# Altium schematic sheet cuatudong.SchDoc
size A3; SheetNumber: 1; SheetTotal: 1
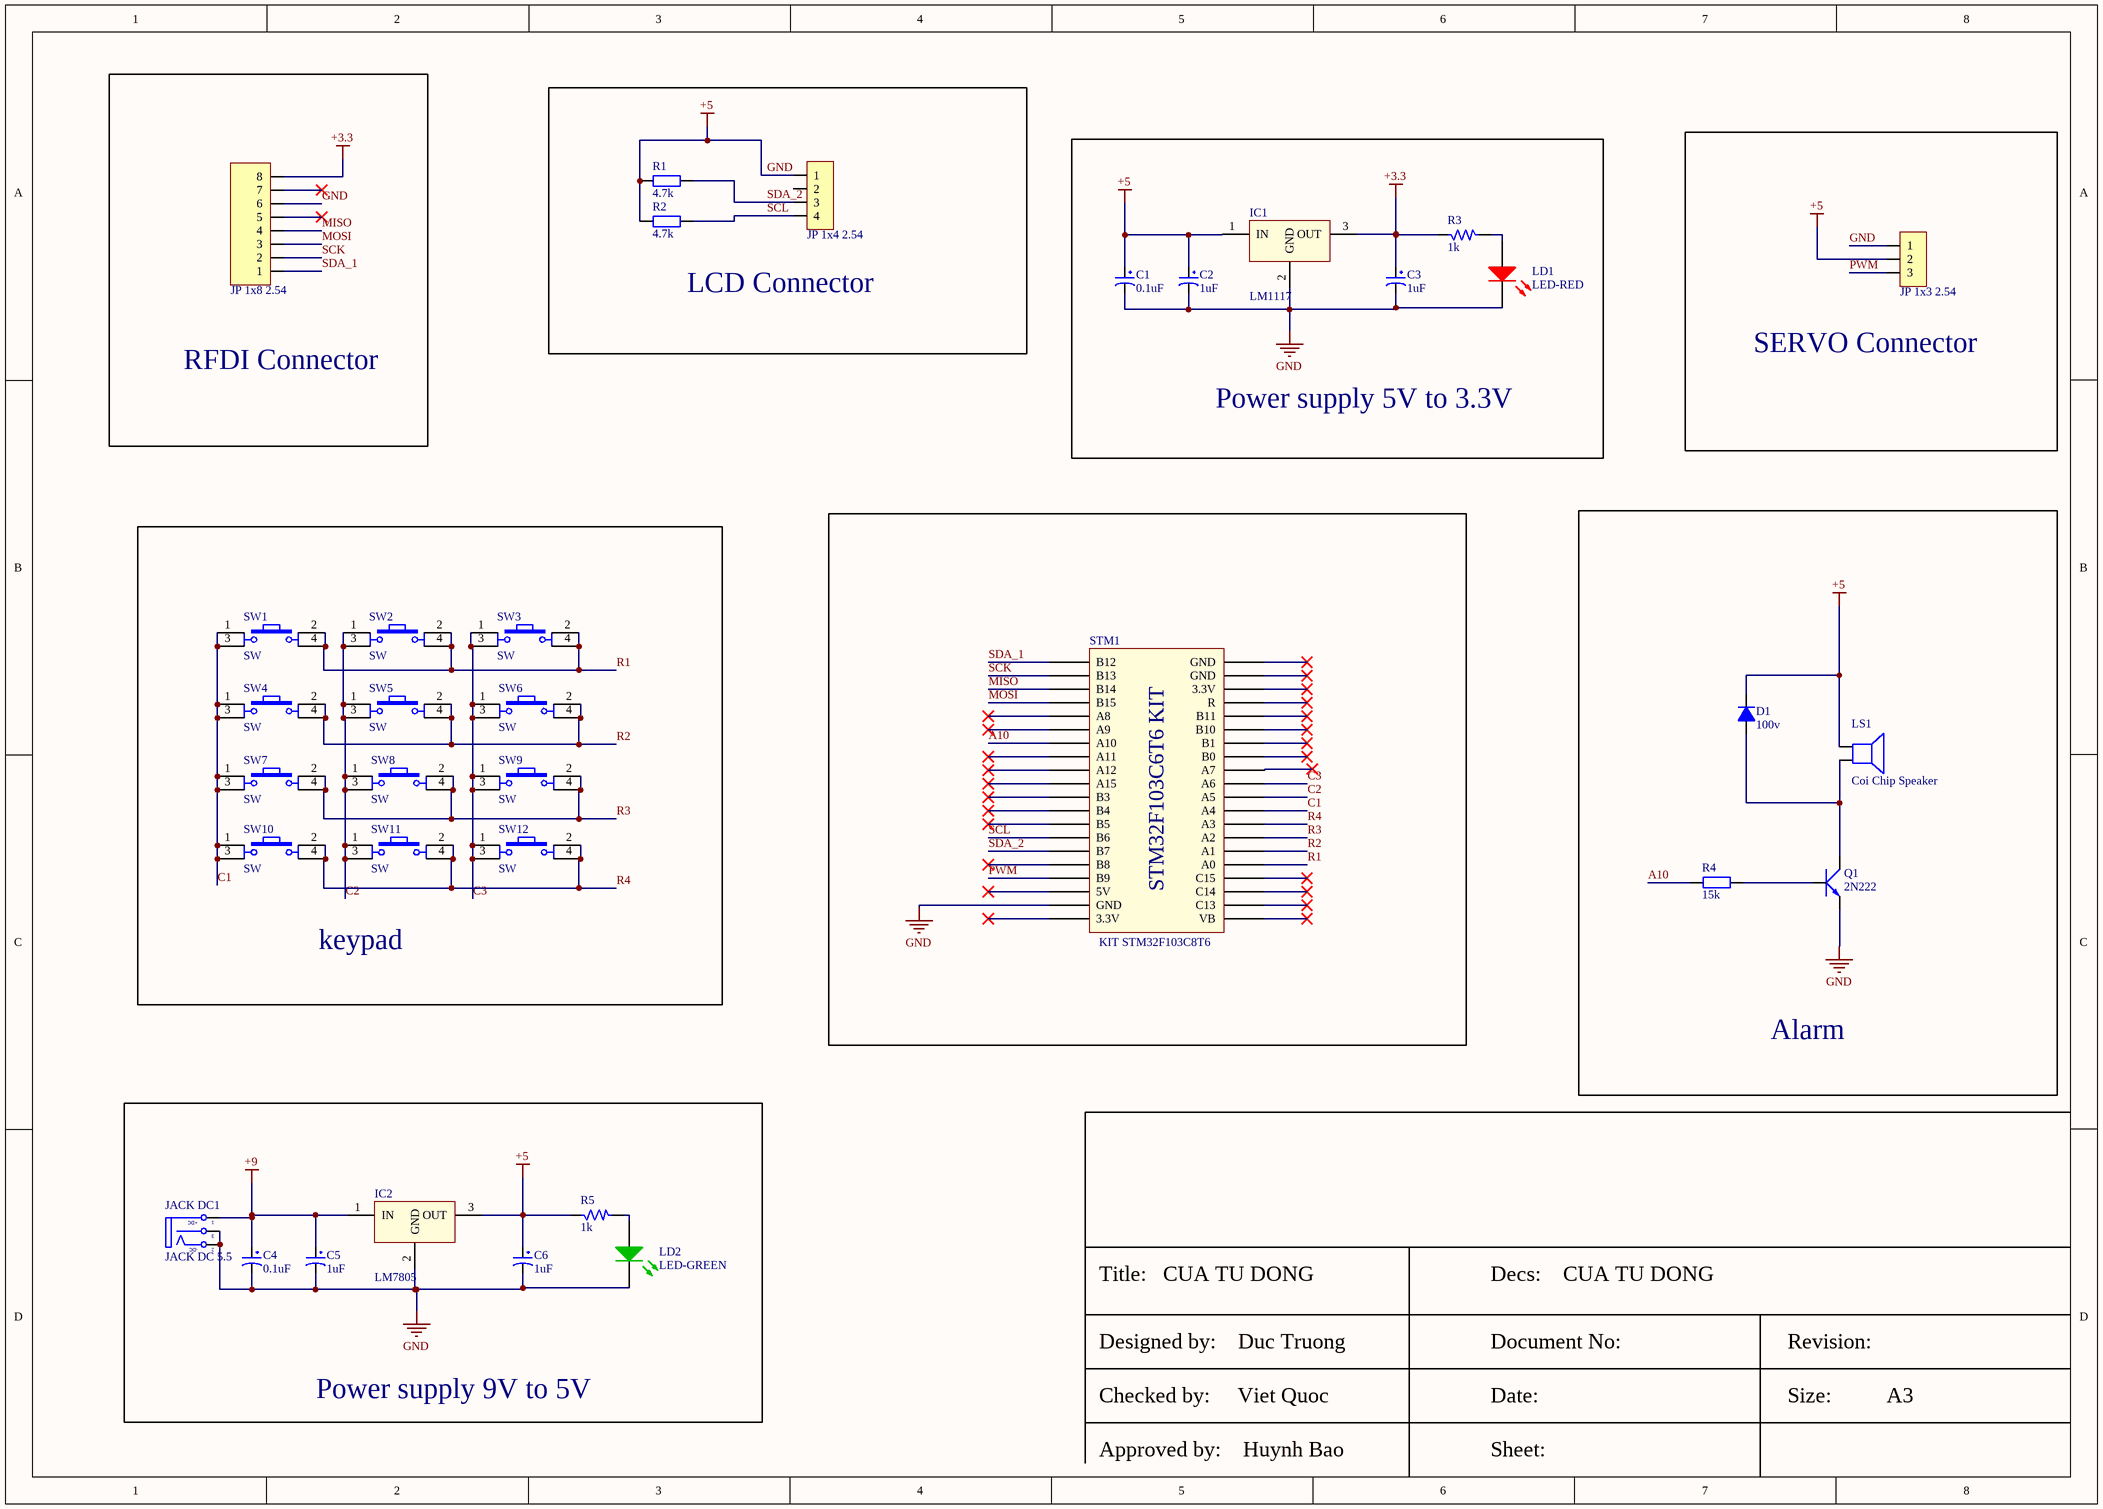
[diagram p0: cuatudong.SchDoc]

## Parts
C1  0.1uF  [tu hoa 5mm]
C2  1uF  [tu hoa 5mm]
C3  1uF  [tu hoa 5mm]
C4  0.1uF  [tu hoa 5mm]
C5  1uF  [tu hoa 5mm]
C6  1uF  [tu hoa 5mm]
D1  100v  [DIODE 0.5A]
IC1  LM1117  [QTO-220]
IC2  LM7805  [QTO-220]
JACK_DC1  JACK DC 5.5  [JACK DC 5.5]
JP1  JP 1x8 2.54  [JP 1x8 CT]
JP2  JP 1x4 2.54  [JP 1x4 CT]
JP3  JP 1x3 2.54  [JP 1x3 DT]
LD1  LED-RED  [LED_SMD0603_RED]
LD2  LED-GREEN  [LED_SMD0805_GREEN]
LS1  Coi Chip Speaker  [Coi Chip Speacker]
Q1  2N222  [TO92]
R1  4.7k  [tro cong suat 5w]
R2  4.7k  [tro cong suat 5w]
R3  1k  [R1/8W]
R4  15k  [tro vach 1/4w]
R5  1k  [R1/8W]
STM1  KIT STM32F103C8T6  [STM32F103 KIT]
SW1  SW  [SW4]
SW2  SW  [SW4]
SW3  SW  [SW4]
SW4  SW  [SW4]
SW5  SW  [SW4]
SW6  SW  [SW4]
SW7  SW  [SW4]
SW8  SW  [SW4]
SW9  SW  [SW4]
SW10  SW  [SW4]
SW11  SW  [SW4]
SW12  SW  [SW4]

## Blocks framed on the sheet
RFDI Connector: JP1
LCD Connector: JP2 R1 R2
Power supply 5V to 3.3V: C1-C3 IC1 LD1 R3
SERVO Connector: JP3
keypad: SW1-SW12
Alarm: D1 LS1 Q1 R4
Power supply 9V to 5V: C4-C6 IC2 JACK_DC1 LD2 R5

## Nets
+3.3: C3.1 IC1.3(OUT) JP1.8 R3.1
+9: C4.1 C5.1 IC2.1(IN) JACK_DC1.1(T)
GND: C1.1 C1.2 C2.1 C2.2 C3.2 C4.2 C5.2 C6.1 C6.2 D1.2(K) IC1.1(IN) IC1.2(GND) IC2.2(GND) IC2.3(OUT) JACK_DC1.2(TN) JACK_DC1.3(S) JP1.6 JP2.1 JP3.1 JP3.2 LD1.2(K) LD2.2(K) LS1.1 Q1.1(E) R1.1 R2.1 R5.1 STM1.19(GND)  [also labelled +5]
A10: R4.1 STM1.7(A10)
C1: STM1.29(A4) SW1.1 SW1.3 SW4.1 SW4.3 SW7.1 SW7.3 SW10.1 SW10.3
C2: STM1.30(A5) SW2.1 SW2.3 SW5.1 SW5.3 SW8.1 SW8.3 SW11.1 SW11.3
C3: STM1.31(A6) SW3.1 SW3.3 SW6.1 SW6.3 SW9.1 SW9.3 SW12.1 SW12.3
MISO: JP1.4 STM1.3(B14)
MOSI: JP1.3 STM1.4(B15)
PWM: JP3.3 STM1.17(B9)
R1: STM1.25(A0) SW1.2 SW1.4 SW2.2 SW2.4 SW3.2 SW3.4
R2: STM1.26(A1) SW4.2 SW4.4 SW5.2 SW5.4 SW6.2 SW6.4
R3: STM1.27(A2) SW7.2 SW7.4 SW8.2 SW8.4 SW9.2 SW9.4
R4: STM1.28(A3) SW10.2 SW10.4 SW11.2 SW11.4 SW12.2 SW12.4
SCK: JP1.2 STM1.2(B13)
SCL: JP2.4 R2.2 STM1.14(B6)
SDA_1: JP1.1 STM1.1(B12)
SDA_2: JP2.3 R1.2 STM1.15(B7)
NetD1_1: D1.1(A) LS1.2 Q1.3(C)
NetLD1_1: LD1.1(A) R3.2
NetLD2_1: LD2.1(A) R5.2
NetQ1_2: Q1.2(B) R4.2

Not connected (* = marked no-connect by the designer): JP1 5* 7*; JP2 2; STM1 5(A8)* 6(A9)* 8(A11)* 9(A12)* 10(A15)* 11(B3)* 12(B4)* 13(B5)* 16(B8)* 18(5V)* 20(3.3V)* 21(VB)* 22(C13)* 23(C14)* 24(C15)* 32(A7)* 33(B0)* 34(B1)* 35(B10)* 36(B11)* 37(R)* 38(3.3V)* 39(GND)* 40(GND)*

## Notes on the sheet
- Title:   CUA TU DONG
- Decs:    CUA TU DONG
- Designed by:    Duc Truong
- Document No:
- Revision:
- Checked by:     Viet Quoc
- Approved by:    Huynh Bao
- Date:
- Sheet:
- Size:          A3
- (in symbol JACK DC 5.5) +DC; -DC
- (in symbol STM32f103 Bluepill) STM32F103C6T6 KIT

## Library data of the parts
C1 C4 = Tu Hoa 0.1uF 50V 5x11: Cắm; Don_Vi: Con; So_Chan: 2; Ten_Linh_Kien: Tụ Hóa 0.1uF 50V; Ma_Hang: MH006853; Chung_Loai: Cắm; Kieu_Chan: *
C2 C3 C5 C6 = Tu Hoa 1uF 400V 6x10: Cắm; Don_Vi: Con; So_Chan: 2; Ten_Linh_Kien: Tụ Hóa 1uF 400V 6x10MM; Ma_Hang: MH003742; Chung_Loai: Cắm; Kieu_Chan: *
D1 = Diode 1N4148: Cắm; Ten_Linh_Kien: Diode 1N4148 DO35 450mA 100V ( 1N4148 DIP); Don_Vi: Con; Ma_Hang: MH001065; Ghi Chu: *; Kieu_Chan: *; Chung_Loai: Cắm
IC1 = LM78xx: On ap +, from + 5 to + 24VDC; Value: LM7805
IC2 = LM78xx: On ap +, from + 5 to + 24VDC; Value: LM7805
JACK_DC1 = JACK DC 5.5: Value: Jac DC
JP1 = JP 1x8 2.54 Cai Thang: Cắm; Ten_Linh_Kien: Jump Đơn Cái 2.54MM 1x20P Thẳng; Don_Vi: Con; Ma_Hang: MH004006; Ghi_Chu: *; Kieu_Chan: *; Chung_Loai: Cắm
JP2 = JP 1x4 2.54 Cai Thang: Cắm; Ten_Linh_Kien: Jump Đơn Cái 2.54MM 1x20P Thẳng; Don_Vi: Con; Ma_Hang: MH004006; Ghi_Chu: *; Kieu_Chan: *; Chung_Loai: Cắm
JP3 = JP 1x3 2.54 Duc Thang: Cắm; Ten_Linh_Kien: Jump Đơn Đực 2.54MM 1x40P Thẳng 11MM; Don_Vi: Con; Ma_Hang: MH000903; Ghi_Chu: *; Kieu_Chan: *; Chung_Loai: Cắm
LD1 = LED_LTST-C191KRKT: LED RED CLEAR 0603 SMD; Manufacturer: Lite-On Inc.; Lens Color: Colorless; Millicandela Rating: 54mcd; Lens Style/Size: Rectangle with Flat Top, 1.10mm x 0.80mm; Voltage - Forward (Vf) (Typ): 2V; Current - Test: 20mA; Viewing Angle: 130°; Wavelength - Dominant: 631nm; Wavelength - Peak: 639nm; Supplier 1: Digi-Key; Manufacturer Part Number: LTST-C191KRKT; RoHS: RoHS Compliant; Category: Optoelectronics; Stock 1: 711347; Pricing 1: 1=0.29, 10=0.211, 25=0.1556, 100=0.1111, 250=0.07556, 500=0.06666, 1000=0.05222, 2500=0.05111 (USD); Packaging: Digi-Reel®; Part Status: Active; Color: Red; Lens Transparency: Clear; Mounting Type: Surface Mount; Features: -; Size / Dimension: 1.60mm L x 0.80mm W; Height (Max): 0.65mm; ComponentLink1URL: http://optoelectronics.liteon.com/upload/download/DS22-2000-223/LTST-C191KRKT.PDF; ComponentLink1Description: http://optoelectronics.liteon.com/upload/download/DS22-2000-223/LTST-C191KRKT.PDF; Supplier Part Number 1: 160-1447-6-ND; Package / Case: 0603 (1608 Metric)
LD2 = LED_LTST-C171KGKT: LED GREEN CLEAR 0805 SMD; Manufacturer: Lite-On Inc.; Lens Color: Colorless; Millicandela Rating: 35mcd; Lens Style/Size: Rectangle with Flat Top, 1.40mm x 1.25mm; Voltage - Forward (Vf) (Typ): 2V; Current - Test: 20mA; Viewing Angle: 130°; Wavelength - Dominant: 571nm; Wavelength - Peak: 574nm; Supplier 1: Digi-Key; Manufacturer Part Number: LTST-C171KGKT; RoHS: RoHS Compliant; Category: Optoelectronics; Stock 1: 329702; Pricing 1: 1=0.35, 10=0.255, 25=0.188, 100=0.1344, 250=0.09136, 500=0.08062, 1000=0.06314 (USD); Packaging: Cut Tape (CT); Part Status: Active; Color: Green; Lens Transparency: Clear; Mounting Type: Surface Mount; Features: -; Size / Dimension: 2.00mm L x 1.25mm W; Height (Max): 0.90mm; ComponentLink1URL: http://optoelectronics.liteon.com/upload/download/DS22-2000-118/LTST-C171KGKT.pdf; ComponentLink1Description: http://optoelectronics.liteon.com/upload/download/DS22-2000-118/LTST-C171KGKT.pdf; Supplier Part Number 1: 160-1426-1-ND; Package / Case: 0805 (2012 Metric)
LS1 = Coi Chip Speaker: Còi chip
Q1 = Trans 2N3904: NPN transistor EBC; Value: C9014
R1 R2 = Tro Cong Suat 5W 5% 4.7k: Cắm; Don_Vi: Con; So_Chan: 2; Ten_Linh_Kien: Trở Sứ 5w 5% 4.7k; Ma_Hang: MH006255; Chung_Loai: Cắm; Kieu_Chan: *
R3 R5 = Res: Resistor 1/4W; Value: R1/4W - 1K
R4 = Tro Vach 1/4W 5% 15k: Cắm; Don_Vi: Con; So_Chan: 2; Ten_Linh_Kien: Trở Vạch 1/4w 5% 15k; Ma_Hang: MH007288; Chung_Loai: Cắm; Kieu_Chan: *
STM1 = STM32f103 Bluepill: KIT STM32F103C8T6 Bluepill
SW1-SW12 = SW4: Switch button 4 pin; Value: Button chip 4 pin